# EAGLE schematic DFPlayer-Wemos-GPIO control (EAGLE 9.6.2)
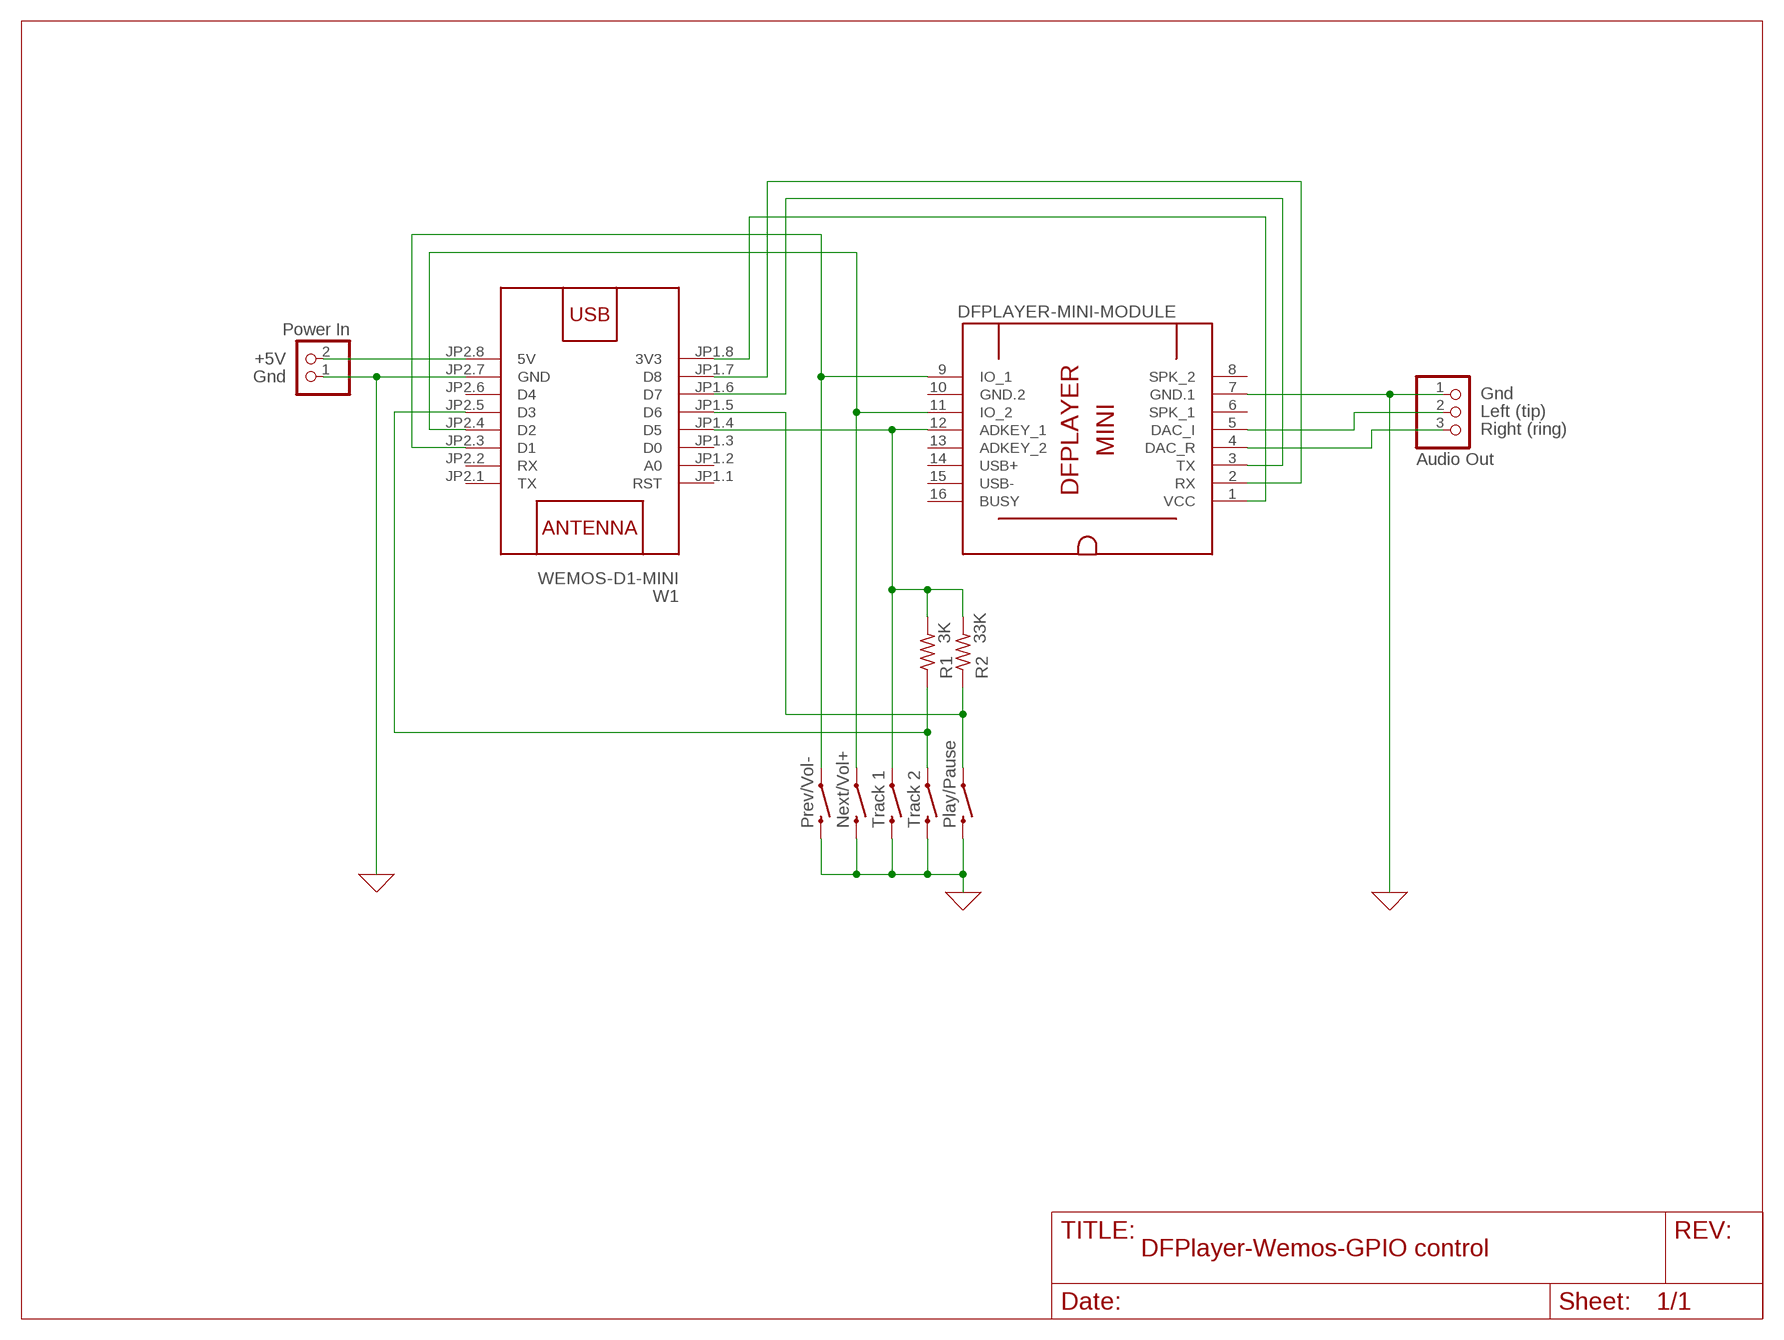
[diagram p0: schematic, sheet 1]

## Parts
JP2  Audio Out  PINHD-1X3  [1X03]
JP3  Power In  PINHD-1X2  [1X02]
R1  3K  R-US_0207/10  [0207/10]
R2  33K  R-US_0207/10  [0207/10]
S2  MOMENTARY-SWITCH-SPST-PTH-6.0MM  [TACTILE_SWITCH_PTH_6.0MM]
S3  MOMENTARY-SWITCH-SPST-PTH-6.0MM  [TACTILE_SWITCH_PTH_6.0MM]
S4  MOMENTARY-SWITCH-SPST-PTH-6.0MM  [TACTILE_SWITCH_PTH_6.0MM]
S5  MOMENTARY-SWITCH-SPST-PTH-6.0MM  [TACTILE_SWITCH_PTH_6.0MM]
S6  MOMENTARY-SWITCH-SPST-PTH-6.0MM  [TACTILE_SWITCH_PTH_6.0MM]
U$1  DFPLAYER-MINI-MODULE  [DFPLAYER-MINI-MODULE]
W1  WEMOS-D1-MINI  [WEMOS-D1-MINI]

## Nets
0: JP2.1 JP3.1 S2.3 S3.3 S4.3 S5.3 S6.3 U$1.7(GND.1) W1.JP2.7(GND) ; supply symbol labelled GND
N$1: U$1.1(VCC) W1.JP1.8(3V3)
N$2: U$1.3(TX) W1.JP1.6(D7)
N$3: JP3.2 W1.JP2.8(5V)
N$4: S2.1 U$1.11(IO_2) W1.JP2.4(D2)
N$5: S3.1 U$1.9(IO_1) W1.JP2.3(D1)
N$6: JP2.2 U$1.5(DAC_I)
N$7: R2.1 S5.1 W1.JP1.5(D6)
N$8: R1.1 S6.1 W1.JP2.5(D3)
N$9: JP2.3 U$1.4(DAC_R)
N$10: U$1.2(RX) W1.JP1.7(D8)
N$13: R1.2 R2.2 S4.1 U$1.12(ADKEY_1) W1.JP1.4(D5)
Unconnected: U$1.6(SPK_1) U$1.8(SPK_2) U$1.13(ADKEY_2) U$1.14(USB+) U$1.15(USB-) U$1.16(BUSY) W1.JP1.1(RST) W1.JP1.2(A0) W1.JP1.3(D0) W1.JP2.1(TX) W1.JP2.2(RX) W1.JP2.6(D4)

## Notes on the sheet
- +5V
- Gnd
- Gnd
- Left (tip)
- Right (ring)
- Prev/Vol- | Next/Vol+ | Track 1 | Track 2 | Play/Pause

## Power pins joined to a net without a drawn wire
GND.2: U$1.10(GND.2)

## Library data of the parts
JP2 = adafruit:PINHD-1X3: PIN HEADER
JP3 = pinhead:PINHD-1X2: PIN HEADER
R1 R2 = adafruit:R-US_: RESISTOR, American symbol
S2-S6 = SparkFun-Switches:MOMENTARY-SWITCH-SPST: Momentary Switch (Pushbutton) - SPST Normally-open (NO) SPST momentary switches (buttons, pushbuttons). Variants PTH-12MM - 12mm square, through-hole Momentary Pushbutton Switch - 12mm Square <https://www.sparkfun.com/products/9190> (COM-09190) PTH-6.0MM, PTH-6.0MM-KIT - 6.0mm square, through-hole Mini Pushbutton Switch <https://www.sparkfun.com/products/97> (COM-00097) KIT package intended for soldering kit's - only one side of pads' copper is exposed. PTH-RIGHT-ANGLE-KIT - Right-angle, through-hole Right Angle Tactile Button <https://www.sparkfun.com/products/10791> - Used on SparkFun BigTime Watch Kit <https://www.sparkfun.com/products/11734> SMD-12MM - 12mm square, surface-mount Tactile Button - SMD (12mm) <https://www.sparkfun.com/products/12993> (COM-12993) Used on SparkFun PicoBoard <https://www.sparkfun.com/products/11888> SMD-4.5MM - 4.5mm Square Trackball Switch Used on SparkFun Blackberry Trackballer Breakout <https://www.sparkfun.com/products/13169> SMD-4.6MMX2.8MM - 4.60mm x 2.80mm, surface mount Used on SparkFun SAMD21 Mini Breakout <https://www.sparkfun.com/products/13664> SMD-5.2MM, SMD-5.2-REDUNDANT - 5.2mm square, surface-mount Mini Pushbutton Switch - SMD <https://www.sparkfun.com/products/8720> (COM-08720) Used on Arduino Pro Mini <https://www.sparkfun.com/products/11114> REDUNDANT package connects both switch circuits together SMD-6.0X3.5MM - 6.0 x 3.5mm, surface mount Momentary Reset Switch SMD <https://www.sparkfun.com/products/8229> (COM-08229) SMD-6.2MM-TALL - 6.2mm square, surface mount Tactile Button - SMD (6mm) <https://www.sparkfun.com/products/12992> Used on SparkFun Digital Sandbox <https://www.sparkfun.com/products/12651> SMD-RIGHT-ANGLE - Right-angle, surface mount Used on SparkFun Block for Intel® Edison - Arduino <https://www.sparkfun.com/products/13036>; PROD_ID: SWCH-08441; SF_SKU: COM-00097
U$1 = diy-modules:DFPLAYER-MINI-MODULE: DFPlayer Mini - MP3 player module based on YX5200 chip More details available here: https://www.dfrobot.com/wiki/index.php/DFPlayer_Mini_SKU:DFR0299 Click here to find device on ebay.com <http://www.ebay.com/sch/dfplayer+mini>
W1 = diy-modules:WEMOS-D1-MINI: WEMOS D1 mini: Mini Wi-Fi Board based on ESP-8266 device More details can be found here: https://www.wemos.cc/product/d1-mini.html Click here to find device on ebay.com <http://www.ebay.com/sch/wemos+d1+mini+nodemcu>